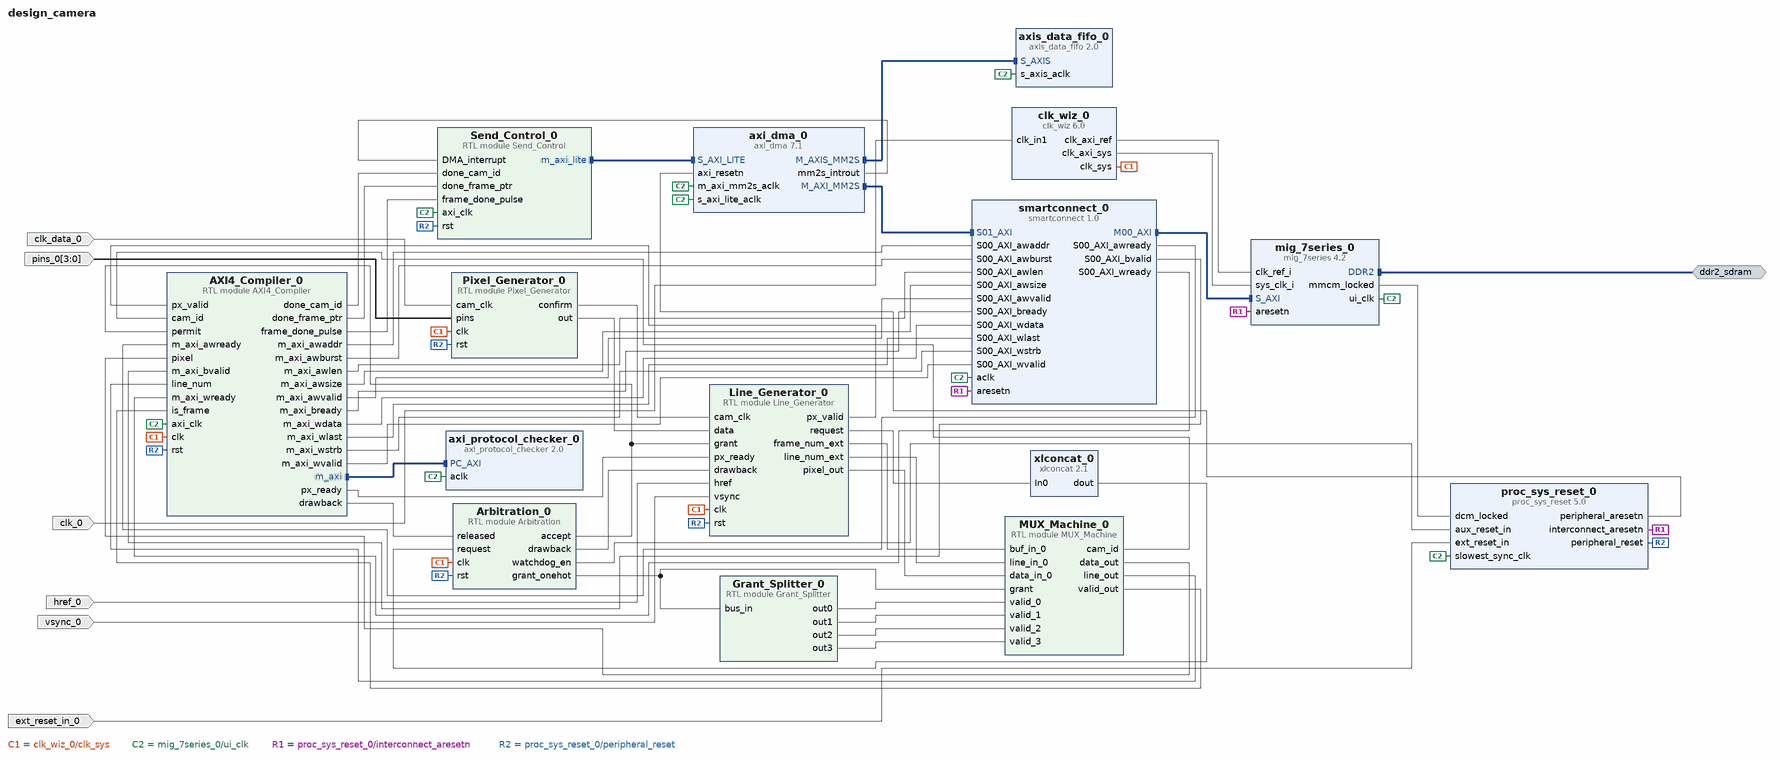
[diagram p0: block diagram of the top level]
# Vivado block design design_camera, xc7a50ticsg324-1L, Vivado 2025.2.1
create_bd_design design_camera

create_bd_intf_port -mode Master -vlnv xilinx.com:interface:ddrx_rtl:1.0 ddr2_sdram
create_bd_port -dir I -from 3 -to 0 pins_0
create_bd_port -dir I -type clk clk_0
create_bd_port -dir I clk_data_0
create_bd_port -dir I href_0
create_bd_port -dir I vsync_0
create_bd_port -dir I -type rst ext_reset_in_0

create_bd_cell -type module -reference Line_Generator Line_Generator_0
create_bd_cell -type module -reference Arbitration Arbitration_0
create_bd_cell -type module -reference AXI4_Compiler AXI4_Compiler_0
create_bd_cell -type module -reference Grant_Splitter Grant_Splitter_0
create_bd_cell -type module -reference MUX_Machine MUX_Machine_0
create_bd_cell -type module -reference Pixel_Generator Pixel_Generator_0
create_bd_cell -type ip -vlnv xilinx.com:ip:xlconcat:2.1 xlconcat_0
set_property -dict {CONFIG.NUM_PORTS 8} [get_bd_cells xlconcat_0]
create_bd_cell -type ip -vlnv xilinx.com:ip:axi_dma:7.1 axi_dma_0
set_property -dict [list \
  CONFIG.c_addr_width 32 \
  CONFIG.c_include_s2mm 0 \
  CONFIG.c_include_sg 0 \
  CONFIG.c_m_axi_mm2s_data_width 64 \
  CONFIG.c_m_axis_mm2s_tdata_width 64 \
  CONFIG.c_mm2s_burst_size 256 \
  CONFIG.c_sg_length_width 24 \
] [get_bd_cells axi_dma_0]
create_bd_cell -type ip -vlnv xilinx.com:ip:axis_data_fifo:2.0 axis_data_fifo_0
create_bd_cell -type ip -vlnv xilinx.com:ip:smartconnect:1.0 smartconnect_0
create_bd_cell -type module -reference Send_Control Send_Control_0
create_bd_cell -type ip -vlnv xilinx.com:ip:mig_7series:4.2 mig_7series_0
set_property -dict [list \
  CONFIG.BOARD_MIG_PARAM ddr2_sdram \
  CONFIG.MIG_DONT_TOUCH_PARAM Custom \
  CONFIG.RESET_BOARD_INTERFACE Custom \
  CONFIG.XML_INPUT_FILE mig_b.prj \
] [get_bd_cells mig_7series_0]
create_bd_cell -type ip -vlnv xilinx.com:ip:clk_wiz:6.0 clk_wiz_0
set_property -dict [list \
  CONFIG.CLKOUT1_DRIVES BUFG \
  CONFIG.CLKOUT1_JITTER 102.086 \
  CONFIG.CLKOUT1_PHASE_ERROR 87.180 \
  CONFIG.CLKOUT1_REQUESTED_OUT_FREQ 200.000 \
  CONFIG.CLKOUT2_DRIVES BUFG \
  CONFIG.CLKOUT2_JITTER 115.831 \
  CONFIG.CLKOUT2_PHASE_ERROR 87.180 \
  CONFIG.CLKOUT2_REQUESTED_OUT_FREQ 100.000 \
  CONFIG.CLKOUT2_USED true \
  CONFIG.CLKOUT3_DRIVES BUFG \
  CONFIG.CLKOUT3_JITTER 90.074 \
  CONFIG.CLKOUT3_PHASE_ERROR 87.180 \
  CONFIG.CLKOUT3_REQUESTED_OUT_FREQ 400.000 \
  CONFIG.CLKOUT3_USED true \
  CONFIG.CLKOUT4_DRIVES BUFG \
  CONFIG.CLKOUT4_JITTER 171.072 \
  CONFIG.CLKOUT4_PHASE_ERROR 87.180 \
  CONFIG.CLKOUT4_REQUESTED_OUT_FREQ 16.000 \
  CONFIG.CLKOUT4_USED true \
  CONFIG.CLKOUT5_DRIVES BUFG \
  CONFIG.CLKOUT6_DRIVES BUFG \
  CONFIG.CLKOUT7_DRIVES BUFG \
  CONFIG.CLK_OUT1_PORT clk_axi_ref \
  CONFIG.CLK_OUT2_PORT clk_axi_sys \
  CONFIG.CLK_OUT3_PORT clk_sys \
  CONFIG.CLK_OUT4_PORT clk_uart \
  CONFIG.FEEDBACK_SOURCE FDBK_AUTO \
  CONFIG.MMCM_BANDWIDTH OPTIMIZED \
  CONFIG.MMCM_CLKFBOUT_MULT_F 12 \
  CONFIG.MMCM_CLKOUT0_DIVIDE_F 6 \
  CONFIG.MMCM_CLKOUT1_DIVIDE 12 \
  CONFIG.MMCM_CLKOUT2_DIVIDE 3 \
  CONFIG.MMCM_CLKOUT3_DIVIDE 75 \
  CONFIG.MMCM_COMPENSATION ZHOLD \
  CONFIG.NUM_OUT_CLKS 4 \
  CONFIG.PRIMITIVE PLL \
] [get_bd_cells clk_wiz_0]
create_bd_cell -type ip -vlnv xilinx.com:ip:axi_protocol_checker:2.0 axi_protocol_checker_0
create_bd_cell -type ip -vlnv xilinx.com:ip:proc_sys_reset:5.0 proc_sys_reset_0
set_property -dict [list \
  CONFIG.C_AUX_RST_WIDTH 4 \
  CONFIG.C_NUM_INTERCONNECT_ARESETN 1 \
  CONFIG.C_NUM_PERP_ARESETN 1 \
] [get_bd_cells proc_sys_reset_0]

# ---- connections ----

connect_bd_intf_net [get_bd_intf_pins AXI4_Compiler_0/m_axi] [get_bd_intf_pins axi_protocol_checker_0/PC_AXI]
connect_bd_intf_net [get_bd_intf_pins Send_Control_0/m_axi_lite] [get_bd_intf_pins axi_dma_0/S_AXI_LITE]
connect_bd_intf_net [get_bd_intf_pins axi_dma_0/M_AXIS_MM2S] [get_bd_intf_pins axis_data_fifo_0/S_AXIS]
connect_bd_intf_net [get_bd_intf_pins axi_dma_0/M_AXI_MM2S] [get_bd_intf_pins smartconnect_0/S01_AXI]
connect_bd_intf_net [get_bd_intf_ports ddr2_sdram] [get_bd_intf_pins mig_7series_0/DDR2]
connect_bd_intf_net [get_bd_intf_pins smartconnect_0/M00_AXI] [get_bd_intf_pins mig_7series_0/S_AXI]
connect_bd_net [get_bd_pins AXI4_Compiler_0/done_cam_id] [get_bd_pins Send_Control_0/done_cam_id]
connect_bd_net [get_bd_pins AXI4_Compiler_0/done_frame_ptr] [get_bd_pins Send_Control_0/done_frame_ptr]
connect_bd_net [get_bd_pins AXI4_Compiler_0/drawback] [get_bd_pins Arbitration_0/released]
connect_bd_net [get_bd_pins AXI4_Compiler_0/frame_done_pulse] [get_bd_pins Send_Control_0/frame_done_pulse]
connect_bd_net [get_bd_pins AXI4_Compiler_0/m_axi_awaddr] [get_bd_pins smartconnect_0/S00_AXI_awaddr]
connect_bd_net [get_bd_pins AXI4_Compiler_0/m_axi_awburst] [get_bd_pins smartconnect_0/S00_AXI_awburst]
connect_bd_net [get_bd_pins AXI4_Compiler_0/m_axi_awlen] [get_bd_pins smartconnect_0/S00_AXI_awlen]
connect_bd_net [get_bd_pins AXI4_Compiler_0/m_axi_awsize] [get_bd_pins smartconnect_0/S00_AXI_awsize]
connect_bd_net [get_bd_pins AXI4_Compiler_0/m_axi_awvalid] [get_bd_pins smartconnect_0/S00_AXI_awvalid]
connect_bd_net [get_bd_pins AXI4_Compiler_0/m_axi_bready] [get_bd_pins smartconnect_0/S00_AXI_bready]
connect_bd_net [get_bd_pins AXI4_Compiler_0/m_axi_wdata] [get_bd_pins smartconnect_0/S00_AXI_wdata]
connect_bd_net [get_bd_pins AXI4_Compiler_0/m_axi_wlast] [get_bd_pins smartconnect_0/S00_AXI_wlast]
connect_bd_net [get_bd_pins AXI4_Compiler_0/m_axi_wstrb] [get_bd_pins smartconnect_0/S00_AXI_wstrb]
connect_bd_net [get_bd_pins AXI4_Compiler_0/m_axi_wvalid] [get_bd_pins smartconnect_0/S00_AXI_wvalid]
connect_bd_net [get_bd_pins AXI4_Compiler_0/px_ready] [get_bd_pins Line_Generator_0/px_ready]
connect_bd_net [get_bd_pins Arbitration_0/accept] [get_bd_pins AXI4_Compiler_0/permit] [get_bd_pins Line_Generator_0/grant]
connect_bd_net [get_bd_pins Arbitration_0/drawback] [get_bd_pins Line_Generator_0/drawback]
connect_bd_net [get_bd_pins Arbitration_0/grant_onehot] [get_bd_pins Grant_Splitter_0/bus_in] [get_bd_pins MUX_Machine_0/grant]
connect_bd_net [get_bd_pins Arbitration_0/watchdog_en] [get_bd_pins proc_sys_reset_0/aux_reset_in]
connect_bd_net [get_bd_pins Grant_Splitter_0/out0] [get_bd_pins MUX_Machine_0/valid_0]
connect_bd_net [get_bd_pins Grant_Splitter_0/out1] [get_bd_pins MUX_Machine_0/valid_1]
connect_bd_net [get_bd_pins Grant_Splitter_0/out2] [get_bd_pins MUX_Machine_0/valid_2]
connect_bd_net [get_bd_pins Grant_Splitter_0/out3] [get_bd_pins MUX_Machine_0/valid_3]
connect_bd_net [get_bd_pins Line_Generator_0/frame_num_ext] [get_bd_pins MUX_Machine_0/buf_in_0]
connect_bd_net [get_bd_pins Line_Generator_0/line_num_ext] [get_bd_pins MUX_Machine_0/line_in_0]
connect_bd_net [get_bd_pins Line_Generator_0/pixel_out] [get_bd_pins MUX_Machine_0/data_in_0]
connect_bd_net [get_bd_pins Line_Generator_0/px_valid] [get_bd_pins AXI4_Compiler_0/px_valid]
connect_bd_net [get_bd_pins Line_Generator_0/request] [get_bd_pins xlconcat_0/In0]
connect_bd_net [get_bd_pins MUX_Machine_0/cam_id] [get_bd_pins AXI4_Compiler_0/cam_id]
connect_bd_net [get_bd_pins MUX_Machine_0/data_out] [get_bd_pins AXI4_Compiler_0/pixel]
connect_bd_net [get_bd_pins MUX_Machine_0/line_out] [get_bd_pins AXI4_Compiler_0/line_num]
connect_bd_net [get_bd_pins MUX_Machine_0/valid_out] [get_bd_pins AXI4_Compiler_0/is_frame]
connect_bd_net [get_bd_pins Pixel_Generator_0/confirm] [get_bd_pins Line_Generator_0/cam_clk]
connect_bd_net [get_bd_pins Pixel_Generator_0/out] [get_bd_pins Line_Generator_0/data]
connect_bd_net [get_bd_pins axi_dma_0/mm2s_introut] [get_bd_pins Send_Control_0/DMA_interrupt]
connect_bd_net -net clk_0_1 [get_bd_ports clk_0] [get_bd_pins clk_wiz_0/clk_in1]
connect_bd_net -net clk_data_0_1 [get_bd_ports clk_data_0] [get_bd_pins Pixel_Generator_0/cam_clk]
connect_bd_net [get_bd_pins clk_wiz_0/clk_axi_ref] [get_bd_pins mig_7series_0/clk_ref_i]
connect_bd_net [get_bd_pins clk_wiz_0/clk_axi_sys] [get_bd_pins mig_7series_0/sys_clk_i]
connect_bd_net [get_bd_pins clk_wiz_0/clk_sys] \
  [get_bd_pins Pixel_Generator_0/clk] [get_bd_pins Arbitration_0/clk] [get_bd_pins AXI4_Compiler_0/clk] \
  [get_bd_pins Line_Generator_0/clk]
connect_bd_net -net ext_reset_in_0_1 [get_bd_ports ext_reset_in_0] [get_bd_pins proc_sys_reset_0/ext_reset_in]
connect_bd_net -net href_0_1 [get_bd_ports href_0] [get_bd_pins Line_Generator_0/href]
connect_bd_net [get_bd_pins mig_7series_0/mmcm_locked] [get_bd_pins proc_sys_reset_0/dcm_locked]
connect_bd_net [get_bd_pins mig_7series_0/ui_clk] \
  [get_bd_pins smartconnect_0/aclk] [get_bd_pins axis_data_fifo_0/s_axis_aclk] [get_bd_pins axi_protocol_checker_0/aclk] \
  [get_bd_pins axi_dma_0/m_axi_mm2s_aclk] [get_bd_pins axi_dma_0/s_axi_lite_aclk] [get_bd_pins AXI4_Compiler_0/axi_clk] \
  [get_bd_pins Send_Control_0/axi_clk] [get_bd_pins proc_sys_reset_0/slowest_sync_clk]
connect_bd_net -net pins_0_1 [get_bd_ports pins_0] [get_bd_pins Pixel_Generator_0/pins]
connect_bd_net [get_bd_pins proc_sys_reset_0/interconnect_aresetn] [get_bd_pins mig_7series_0/aresetn] [get_bd_pins smartconnect_0/aresetn]
connect_bd_net [get_bd_pins proc_sys_reset_0/peripheral_aresetn] [get_bd_pins axi_dma_0/axi_resetn]
connect_bd_net [get_bd_pins proc_sys_reset_0/peripheral_reset] \
  [get_bd_pins AXI4_Compiler_0/rst] [get_bd_pins Send_Control_0/rst] [get_bd_pins Pixel_Generator_0/rst] \
  [get_bd_pins Arbitration_0/rst] [get_bd_pins Line_Generator_0/rst]
connect_bd_net [get_bd_pins smartconnect_0/S00_AXI_awready] [get_bd_pins AXI4_Compiler_0/m_axi_awready]
connect_bd_net [get_bd_pins smartconnect_0/S00_AXI_bvalid] [get_bd_pins AXI4_Compiler_0/m_axi_bvalid]
connect_bd_net [get_bd_pins smartconnect_0/S00_AXI_wready] [get_bd_pins AXI4_Compiler_0/m_axi_wready]
connect_bd_net -net vsync_0_1 [get_bd_ports vsync_0] [get_bd_pins Line_Generator_0/vsync]
connect_bd_net [get_bd_pins xlconcat_0/dout] [get_bd_pins Arbitration_0/request]

validate_bd_design
save_bd_design
